# EAGLE design Xonik Noise A6 (EAGLE 6.5.0)
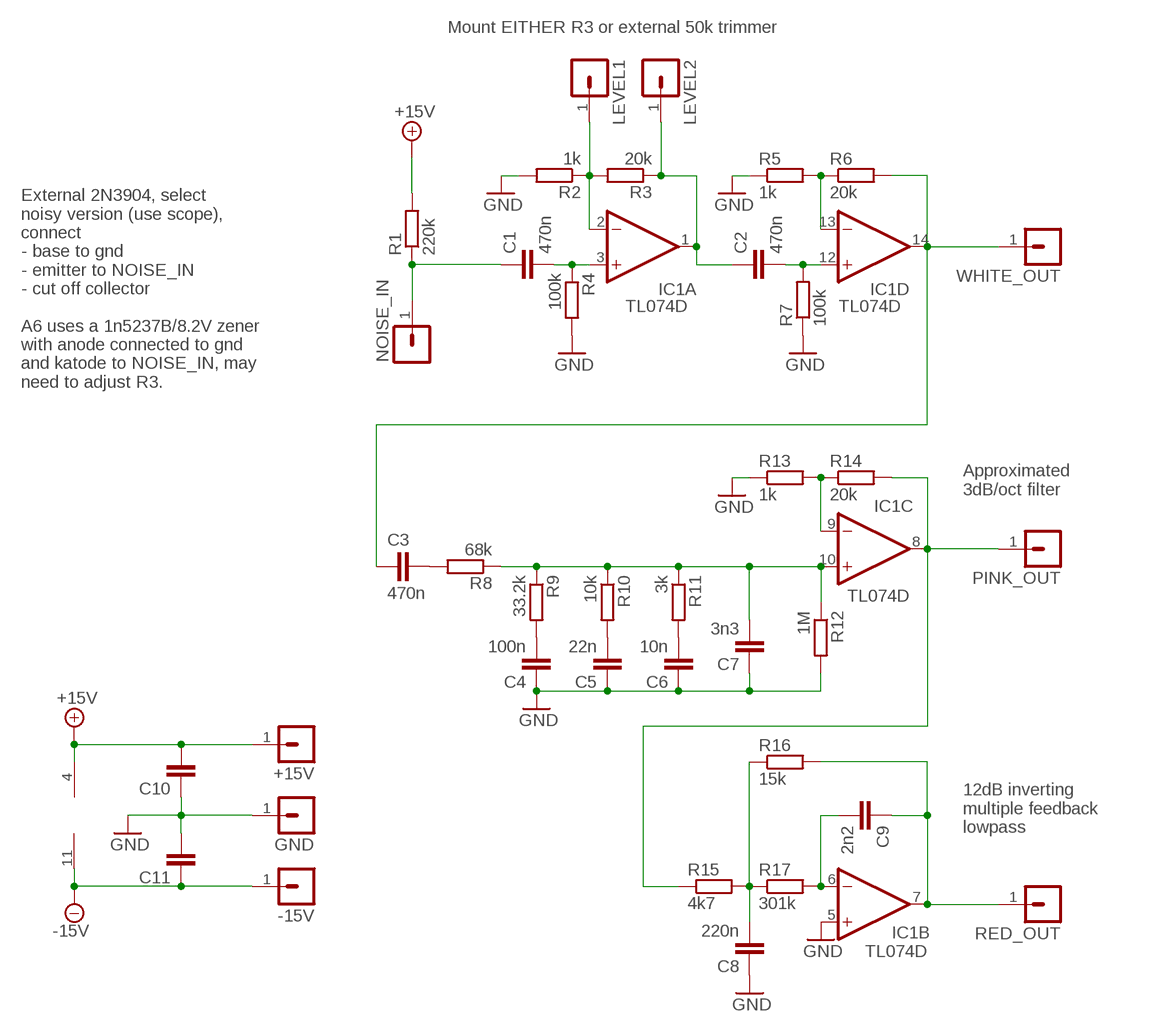
[diagram p0: schematic, sheet 1]

## Parts
+15V  MA01-1JP  [SIP-PIN01-1J]
-15V  MA01-1JP  [SIP-PIN01-1J]
C1  470n  C-EUC0805  [C0805]
C2  470n  C-EUC0805  [C0805]
C3  470n  C-EUC0805  [C0805]
C4  100n  C-EUC0805  [C0805]
C5  22n  C-EUC0805  [C0805]
C6  10n  C-EUC0805  [C0805]
C7  3n3  C-EUC0805  [C0805]
C8  220n  C-EUC0805  [C0805]
C9  2n2  C-EUC0805  [C0805]
C10  C-EUC0603  [C0603]
C11  C-EUC0603  [C0603]
GND  MA01-1JP  [SIP-PIN01-1J]
IC1  TL074D  [SO14]
LEVEL1  MA01-1JP  [SIP-PIN01-1J]
LEVEL2  MA01-1JP  [SIP-PIN01-1J]
NOISE_IN  MA01-1JP  [SIP-PIN01-1J]
PINK_OUT  MA01-1JP  [SIP-PIN01-1J]
R1  220k  R-EU_R0805  [R0805]
R2  1k  R-EU_R0805  [R0805]
R3  20k  R-EU_R0805  [R0805]
R4  100k  R-EU_R0805  [R0805]
R5  1k  R-EU_R0805  [R0805]
R6  20k  R-EU_R0805  [R0805]
R7  100k  R-EU_R0805  [R0805]
R8  68k  R-EU_R0805  [R0805]
R9  33.2k  R-EU_R0805  [R0805]
R10  10k  R-EU_R0805  [R0805]
R11  3k  R-EU_R0805  [R0805]
R12  1M  R-EU_R0805  [R0805]
R13  1k  R-EU_R0805  [R0805]
R14  20k  R-EU_R0805  [R0805]
R15  4k7  R-EU_R0805  [R0805]
R16  15k  R-EU_R0805  [R0805]
R17  301k  R-EU_R0805  [R0805]
RED_OUT  MA01-1JP  [SIP-PIN01-1J]
WHITE_OUT  MA01-1JP  [SIP-PIN01-1J]

## Nets
+15V: +15V.1 C10.2 IC1.4(P:V+) R1.2
-15V: -15V.1 C11.1 IC1.11(P:V-)
GND: C4.1 C5.1 C6.1 C7.1 C8.1 C10.1 C11.2 GND.1 IC1.5(B:+IN) R2.2 R4.2 R5.1 R7.1 R12.2 R13.1
N$1: IC1.2(A:-IN) LEVEL1.1 R2.1 R3.2
N$2: IC1.13(D:-IN) R5.2 R6.1
N$3: IC1.9(C:-IN) R13.2 R14.1
N$4: C4.2 R9.2
N$5: C5.2 R10.2
N$6: C6.2 R11.2
N$7: C1.1 NOISE_IN.1 R1.1
N$8: C1.2 IC1.3(A:+IN) R4.1
N$9: C2.1 IC1.1(A:OUT) LEVEL2.1 R3.1
N$10: C2.2 IC1.12(D:+IN) R7.2
N$11: C3.1 IC1.14(D:OUT) R6.2 WHITE_OUT.1
N$12: C7.2 IC1.10(C:+IN) R8.1 R9.1 R10.1 R11.1 R12.1
N$13: C3.2 R8.2
N$14: IC1.8(C:OUT) PINK_OUT.1 R14.2 R15.1
N$16: C8.2 R15.2 R16.1 R17.1
N$17: C9.2 IC1.6(B:-IN) R17.2
N$18: C9.1 IC1.7(B:OUT) R16.2 RED_OUT.1

## Notes on the sheet
- Mount EITHER R3 or external 50k trimmer
- External 2N3904, select
  noisy version (use scope),
  connect 
  - base to gnd
  - emitter to NOISE_IN
  - cut off collector
  
  A6 uses a 1n5237B/8.2V zener
  with anode connected to gnd 
  and katode to NOISE_IN, may
  need to adjust R3.
- Approximated
  3dB/oct filter
- 12dB inverting
  multiple feedback
  lowpass

## Library data of the parts
+15V -15V GND LEVEL1 LEVEL2 NOISE_IN PINK_OUT RED_OUT WHITE_OUT = joakim:MA01-1J: PIN HEADER
C1-C11 = resistor:C-EU: CAPACITOR, European symbol
IC1 = linear:TL074: OP AMP
R1-R17 = resistor:R-EU_: RESISTOR, European symbol

## Board
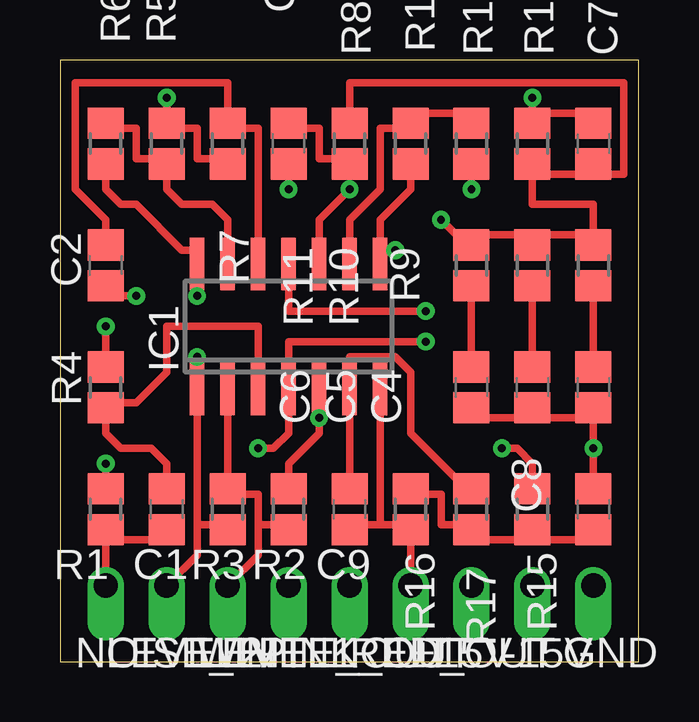
[diagram p1: board, top side]
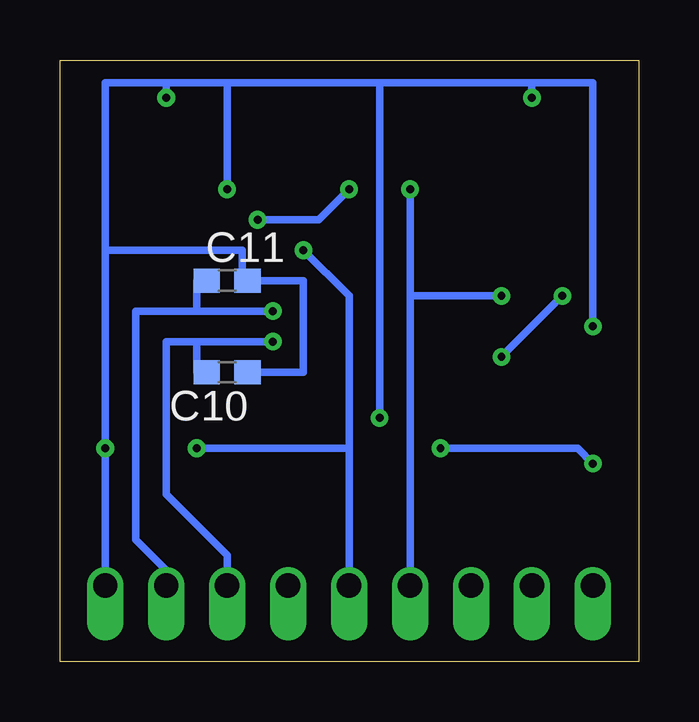
[diagram p2: board, bottom side, seen from below]

Size 24.11 x 25.07 mm. Coordinates in mm from the lower left corner, seen from the top.
Outline: 0,0 24.11,0 24.11,25.07 0,25.07 0,0
Copper layers (1*16): Top 0.035mm / dielectric 1.5mm / Bottom 0.035mm
Design rules "default": minimum track width 10mil, minimum drill 24mil, track to track 8mil, track to pad 8mil, pad to pad 8mil, via to via 8mil, smd to smd 8mil, copper to edge 40mil, drill to drill 8mil, minimum pad ring 10mil, minimum via ring 8mil, stop-mask expansion 4mil, vias tented up to drill 0mil, thermal gap 10mil

### Footprints (pad centres in the part's own frame; a part is rotated, then mirrored left to right if it is on the bottom)
SIP-PIN01-1J = drill 1.016 offset: 1 0,0
C0805 = smd 1.3 x 1.5: 1 -0.85,0; 2 0.85,0
C0603 = smd 1.1 x 1: 1 -0.85,0; 2 0.85,0
SO14 = smd 0.6 x 2.2: 1 -3.81,-2.6; 2 -2.54,-2.6; 3 -1.27,-2.6; 4 0,-2.6; 5 1.27,-2.6; 6 2.54,-2.6; 7 3.81,-2.6; 8 3.81,2.6; 9 2.54,2.6; 10 1.27,2.6; 11 0,2.6; 12 -1.27,2.6; 13 -2.54,2.6; 14 -3.81,2.6
R0805 = smd 1.3 x 1.5: 1 -0.85,0; 2 0.85,0

### Placement (x,y rotation side)
+15V  17.14,3.17 0 top
-15V  19.68,3.17 0 top
C1  4.45,6.35 90 top
C2  1.91,16.51 90 top
C3  9.53,21.59 90 top
C4  22.23,11.43 90 top
C5  19.68,11.43 90 top
C6  17.14,11.43 90 top
C7  22.23,21.59 270 top
C8  22.23,6.35 270 top
C9  12.06,6.35 90 top
C10  17.14,12.06 180 bottom
C11  17.14,15.88 0 bottom
GND  22.23,3.17 0 top
IC1  9.53,13.97 0 top
LEVEL1  6.99,3.17 0 top
LEVEL2  4.45,3.17 0 top
NOISE_IN  1.91,3.17 0 top
PINK_OUT  12.06,3.17 0 top
R1  1.91,6.35 90 top
R2  9.53,6.35 90 top
R3  6.99,6.35 90 top
R4  1.91,11.43 90 top
R5  4.45,21.59 270 top
R6  1.91,21.59 270 top
R7  6.99,21.59 90 top
R8  12.06,21.59 270 top
R9  22.23,16.51 270 top
R10  19.68,16.51 270 top
R11  17.14,16.51 270 top
R12  19.68,21.59 90 top
R13  17.14,21.59 90 top
R14  14.61,21.59 270 top
R15  19.68,6.35 270 top
R16  14.61,6.35 270 top
R17  17.14,6.35 90 top
RED_OUT  14.61,3.17 0 top
WHITE_OUT  9.53,3.17 0 top

### Tracks (layer width: path | path; a pad name or v marks a point on that pad's centre or on a via)
+15V  (via drill 0.33)
  Top 0.305: v15.24,13.34 9.53,13.34 IC1.4 9.53,9.53 8.89,8.89 v8.26,8.89 | R1.2 v1.91,8.26
  Bottom 0.305: v15.24,13.34 18.41,13.34 | 18.41,13.34 19.68,13.34 19.68,6.99 17.14,4.45 +15V.1 | v1.91,8.26 2.54,8.89 v8.26,8.89 | C10.2 18.41,12.06 18.41,13.34
-15V  (via drill 0.33)
  Top 0.305: IC1.11 9.53,14.61 v15.24,14.61
  Bottom 0.305: v15.24,14.61 18.41,14.61 | 18.41,14.61 20.95,14.61 20.95,5.08 19.68,3.81 -15V.1 | C11.1 18.41,15.88 18.41,14.61
GND  (via drill 0.33)
  Top 0.305: R2.2 9.53,8.26 10.79,9.53 v10.79,10.16 IC1.5 | v4.45,23.5 R5.1 4.45,22.23 5.71,22.23 5.71,20.95 6.77,20.95 R7.1 | 2.33,12.7 R4.2 v1.91,13.97 | C4.1 22.23,10.16 | 19.47,10.16 C5.1 19.68,10.16 | 19.68,10.16 19.47,10.16 | 19.47,10.16 17.57,10.16 | 17.57,10.16 C6.1 17.14,10.16 17.57,10.16 | v19.68,23.5 19.68,22.86 | R12.2 19.68,22.86 | 19.68,22.86 21.8,22.86 C7.1 | v17.14,19.68 R13.1 | 19.68,10.16 22.23,10.16 | 22.23,10.16 v22.23,8.89 C8.1
  Bottom 0.305: 4.45,24.13 10.79,24.13 | 10.79,24.13 v10.79,10.16 | v4.45,23.5 4.45,24.13 | 4.45,24.13 1.91,24.13 v1.91,13.97 | 10.79,24.13 17.14,24.13 | 17.14,24.13 v17.14,19.68 | 17.14,24.13 19.68,24.13 | 22.23,8.26 GND.1 v22.23,8.89 22.23,17.14 | 22.23,17.14 22.23,24.13 19.68,24.13 | 19.68,24.13 v19.68,23.5 | C10.1 13.97,12.06 13.97,15.88 C11.2 16.51,15.88 16.51,17.14 22.23,17.14
N$1
  Top 0.305: IC1.2 R3.2 6.99,6.99 8.26,6.99 8.26,5.71 | 8.26,5.71 9.31,5.71 R2.1 | LEVEL1.1 8.26,4.45 8.26,5.71
N$2
  Top 0.305: R6.1 1.91,22.23 3.17,22.23 3.17,20.95 4.23,20.95 R5.2 4.45,19.68 5.08,19.05 6.35,19.05 6.99,18.41 IC1.13
N$3
  Top 0.305: IC1.9 12.06,18.41 13.34,19.68 13.34,22.23 14.39,22.23 R14.1 14.61,22.86 16.73,22.86 R13.2
N$4
  Top 0.305: C4.2 R9.2
N$5
  Top 0.305: C5.2 R10.2
N$6
  Top 0.305: C6.2 R11.2
N$7
  Top 0.305: NOISE_IN.1 R1.1 2.33,5.08 4.45,5.08 C1.1
N$8
  Top 0.305: C1.2 4.45,8.26 3.81,8.89 2.54,8.89 1.91,9.53 R4.1 1.91,10.79 3.17,10.79 4.45,12.06 4.45,13.97 8.26,13.97 IC1.3
N$9  (via drill 0.33)
  Top 0.305: LEVEL2.1 5.71,4.45 5.71,5.71 | 5.71,5.71 IC1.1 v5.71,12.7 | 5.71,5.71 6.77,5.71 R3.1 | v3.17,15.24 1.91,15.24 C2.1
  Bottom 0.305: v5.71,12.7 v3.17,15.24
N$10
  Top 0.305: IC1.12 8.26,22.23 7.2,22.23 R7.2 6.99,24.13 0.64,24.13 0.64,19.68 1.91,18.41 C2.2
N$11  (via drill 0.33)
  Top 0.305: v5.71,15.24 IC1.14 5.71,17.14 5.08,17.14 3.17,19.05 2.54,19.05 1.91,19.68 R6.2 | C3.1 v9.53,19.68
  Bottom 0.305: WHITE_OUT.1 9.53,15.24 | 9.53,15.24 v5.71,15.24 | v9.53,19.68 9.53,15.24
N$12  (via drill 0.33)
  Top 0.305: IC1.10 10.79,18.41 v12.06,19.68 | R8.1 12.06,24.13 23.5,24.13 23.5,20.32 22.64,20.32 C7.2 22.23,20.32 20.11,20.32 R12.1 19.68,19.05 22.23,19.05 R9.1 21.8,17.78 19.68,17.78 R10.1 19.27,17.78 17.14,17.78 R11.1 16.73,17.78 16.51,17.78 v15.88,18.41
  Bottom 0.305: v15.88,18.41 13.34,18.41 v12.06,19.68
N$13
  Top 0.305: 9.53,22.86 C3.2 9.53,22.23 10.79,22.23 10.79,20.95 11.85,20.95 R8.2
N$14  (via drill 0.33)
  Top 0.305: IC1.8 13.34,18.41 14.61,19.68 R14.2 | R15.1 19.68,8.26 19.05,8.89 v18.41,8.89 | v13.97,17.14 13.34,17.14 IC1.8 | 13.39,16.51 IC1.8
  Bottom 0.305: v18.41,8.89 12.06,8.89 | 12.06,8.89 12.06,15.24 v13.97,17.14 | PINK_OUT.1 12.06,8.89
N$16
  Top 0.305: R16.1 14.61,6.99 15.88,6.99 15.88,5.71 16.93,5.71 R17.1 17.14,5.08 19.47,5.08 R15.2 19.68,5.08 22.23,5.08 C8.2
N$17
  Top 0.305: C9.2 IC1.6 12.06,12.7 13.97,12.7 14.61,12.06 14.61,9.53 16.93,7.2 R17.2
N$18
  Top 0.305: C9.1 12.06,5.71 13.34,5.71 | 13.34,5.71 14.61,5.71 R16.2 RED_OUT.1 | IC1.7 13.34,5.71